# Altium schematic sheet Control.SchDoc
size A4
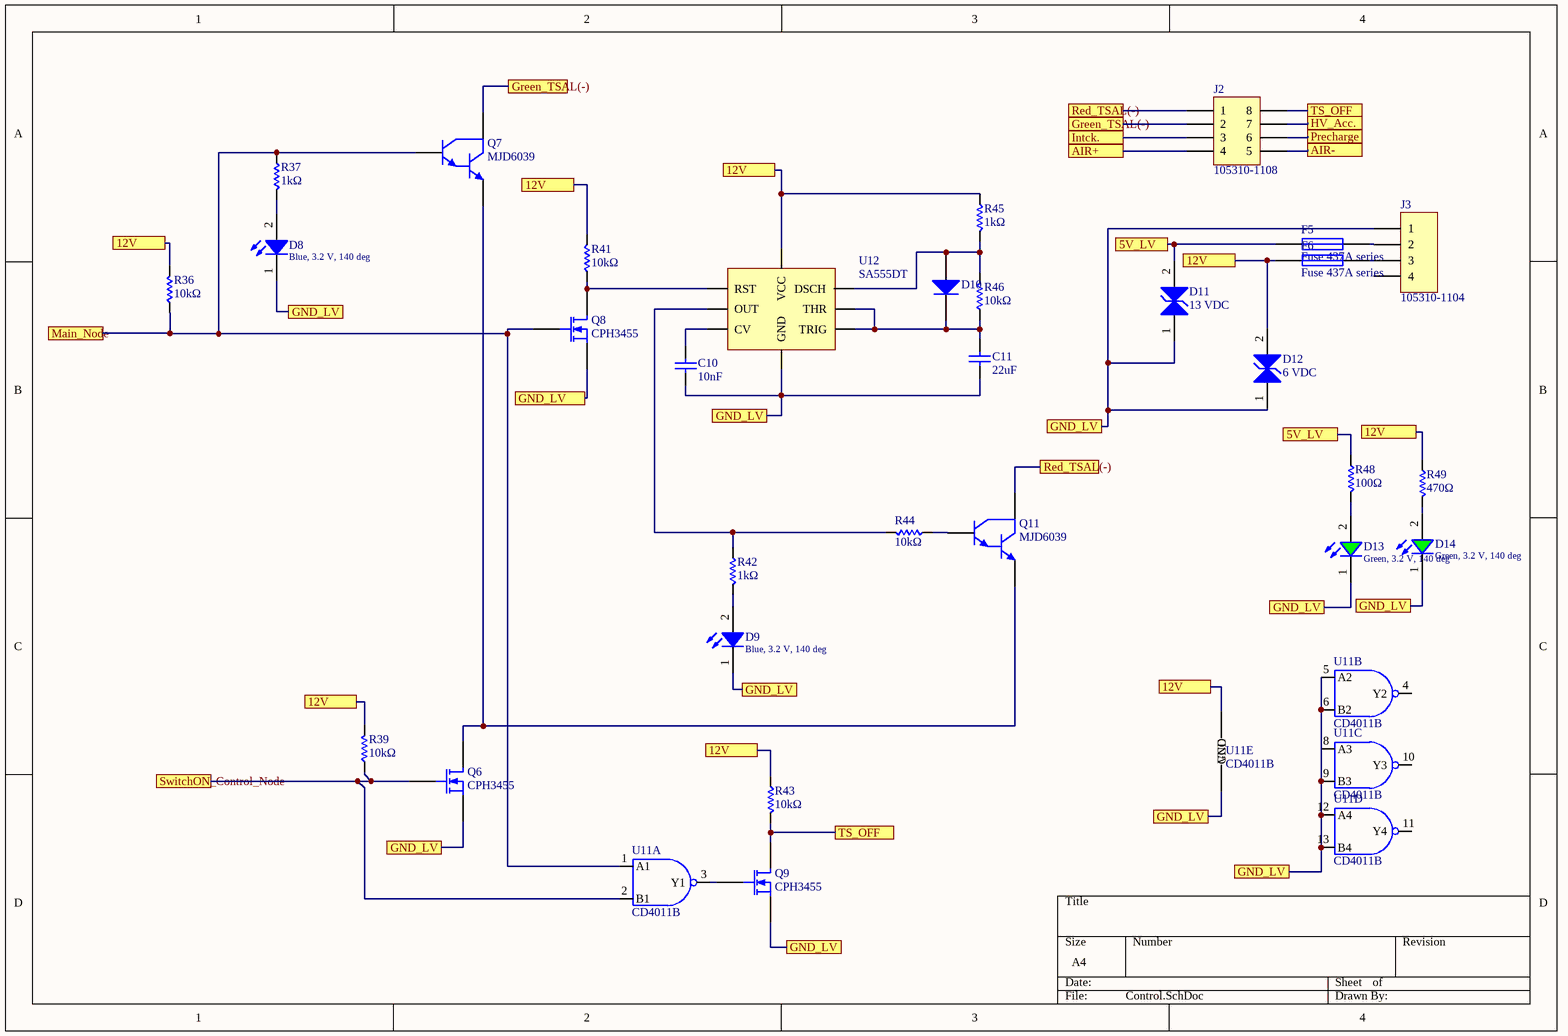
[diagram p0: Control.SchDoc]

## Parts
C10  10nF  [0805_2x1.25x0.8mm_Reflow Soldering]
C11  22uF  [0805_2x1.25x1.25mm_Reflow Soldering]
D8  Blue, 3.2 V, 140 deg  [WL-SMCW_0805]
D9  Blue, 3.2 V, 140 deg  [WL-SMCW_0805]
D10  (no value)  [MBR0540T1G]
D11  13 VDC  [WE-TVSP_DO-214AC_Bidirectional]
D12  6 VDC  [WE-TVSP_DO-214AC_Bidirectional]
D13  Green, 3.2 V, 140 deg  [WL-SMCW_0805]
D14  Green, 3.2 V, 140 deg  [WL-SMCW_0805]
F5  Fuse 437A series  [437A_Series]
F6  Fuse 437A series  [437A_Series]
J2  105310-1108  [105310-1108]
J3  105310-1104  [105310-1104]
Q6  CPH3455  [CPH3455]
Q7  MJD6039  [MJD6039]
Q8  CPH3455  [CPH3455]
Q9  CPH3455  [CPH3455]
Q11  MJD6039  [MJD6039]
R36  10kΩ  [CR0805]
R37  1kΩ  [CR0805]
R39  10kΩ  [CR0805]
R41  10kΩ  [CR0805]
R42  1kΩ  [CR0805]
R43  10kΩ  [CR0805]
R44  10kΩ  [CR0805]
R45  1kΩ  [CR0805]
R46  10kΩ  [CR0805]
R48  100Ω  [CR0805]
R49  470Ω  [CR0805]
U11  CD4011B  [CD4011BM]  (parts A,B,C,D,E of 5)
U12  SA555DT  [SA555DT]

## Ports
5V_LV, 12V, AIR+, AIR-, GND_LV, Green_TSAL(-), HV_Acc., Intck., Main_Node, Precharge, Red_TSAL(-), SwitchON_Control_Node, TS_OFF

## Nets
5V_LV: D11.2(C) F5.1 R48.2 ; port 5V_LV
12V: D12.2(C) F6.1 R36.1 R39.1 R41.1 R43.2 R45.2 R49.2 U11.14(VCC) U12.8(VCC) ; port 12V
AIR+: J2.4 ; port AIR+
AIR-: J2.5 ; port AIR-
GND_LV: C10.1 C11.1 D8.1(K) D9.1(K) D11.1(C) D12.1(C) D13.1(K) D14.1(K) J3.1 Q6.3(S) Q8.3(S) Q9.3(S) U11.5(A2) U11.6(B2) U11.7(GND) U11.8(A3) U11.9(B3) U11.12(A4) U11.13(B4) U12.1(GND) ; port GND_LV
Green_TSAL(-): J2.2 Q7.2(C) ; port Green_TSAL(-)
HV_Acc.: J2.7 ; port HV_Acc.
Intck.: J2.3 ; port Intck.
Main_Node: Q7.1(B) Q8.1(G) R36.2 R37.2 U11.1(A1) ; port Main_Node
Precharge: J2.6 ; port Precharge
Red_TSAL(-): J2.1 Q11.2(C) ; port Red_TSAL(-)
SwitchON_Control_Node: Q6.1(G) R39.2 U11.2(B1) ; port SwitchON_Control_Node
TS_OFF: J2.8 Q9.2(D) R43.1 ; port TS_OFF
NetC10_2: C10.2 U12.5(CV)
NetC11_2: C11.2 D10.1(K) R46.2 U12.2(TRIG) U12.6(THR)
NetD8_2: D8.2(A) R37.1
NetD9_2: D9.2(A) R42.1
NetD10_2: D10.2(A) R45.1 R46.1 U12.7(DSCH)
NetD13_2: D13.2(A) R48.1
NetD14_2: D14.2(A) R49.1
NetF5_2: F5.2 J3.2
NetF6_2: F6.2 J3.3
NetQ6_2: Q6.2(D) Q7.3(E) Q11.3(E)
NetQ8_2: Q8.2(D) R41.2 U12.4(RST)
NetQ9_1: Q9.1(G) U11.3(Y1)
NetQ11_1: Q11.1(B) R44.2
NetR42_2: R42.2 R44.1 U12.3(OUT)

Not connected (* = marked no-connect by the designer): J3 4; U11 4(Y2) 10(Y3) 11(Y4)

## Library data of the parts
C10 = 885012207092: WCAP-CSGP Ceramic Capacitors, 0805, X7R, 50V, 10nF; Rated Voltage: 50V DC; ComponentLink1Description: Manufacturer; ComponentLink1URL: http://www.we-online.de; ComponentLink2Description: Datasheet; ComponentLink2URL: http://katalog.we-online.de/pbs/datasheet/885012207092.pdf; Part Number: 885012207092; Published Date: Oct. 2017; Publisher: Wurth Elektronik; Size: 0805; Operating Temperature: -55 °C to +125 °C; Value: 10nF; Ceramic Type: X7R
C11 = 885012107011: WCAP-CSGP Ceramic Capacitors, 0805, X5R, 10V, 22uF; Rated Voltage: 10V DC; ComponentLink1Description: Manufacturer; ComponentLink1URL: http://www.we-online.de; ComponentLink2Description: Datasheet; ComponentLink2URL: http://katalog.we-online.de/pbs/datasheet/885012107011.pdf; Part Number: 885012107011; Published Date: Oct. 2017; Publisher: Wurth Elektronik; Size: 0805; Operating Temperature: -55 °C to +125 °C; Value: 22uF; Ceramic Type: X5R
D8 D9 = 150080BS75000: SMT Mono-color Chip LED Waterclear WL-SMCW, size 0805, Blue, 3.2 V, 140 deg, 145 mcd; Forward Voltage: 3.2 V; Viewing Angle: 140 deg; Peak Wavelength: 465 nm; Dominant Wavelength: 470 nm; Luminous Intensity: 145 mcd; Chip Technology: InGaN; ComponentLink1Description: Manufacturer; ComponentLink1URL: http://www.we-online.de; ComponentLink2Description: Datasheet; ComponentLink2URL: https://katalog.we-online.de/led/datasheet/150080BS75000.pdf; Part Number: 150080BS75000; Published Date: November 2018; Publisher: Wurth Elektronik; Size: 0805; Operating Temperature: -40 to 85 degC; Emitting Color: Blue; Mounting Technology: SMT; Packaging: Tape and Reel
D10 = MBR0540T1G: Surface Mount / Schottky Power Rectifier; Manufacturer: ON Semiconductor; ComponentLink1Description: Datasheet; ComponentLink1URL: https://www.onsemi.com/pub/Collateral/MBR0540T1-D.PDF
D11 = 824501131: WE-TVSP Power TVS Diode, size DO-214AC, Bidirectional, 400 W, 13 VDC; Peak Pulse Current: 18.6 A; Power Dissipation: 400 W; Reverse Breakdown Voltage: 15.15 V; Reverse Stand-Off Voltage: 13 V; Surge Clamping Voltage: 21.5 V; ComponentLink1Description: Manufacturer; ComponentLink1URL: http://www.we-online.de; ComponentLink2Description: Datasheet; ComponentLink2URL: https://katalog.we-online.de/pbs/datasheet/824501131.pdf; Part Number: 824501131; Published Date: September 2018; Publisher: Wurth Elektronik; Size: DO-214AC; Operating Temperature: -65 to 150 degC; Mounting Technology: SMT; Packaging: Tape and Reel; Polarity: Bidirectional
D12 = 824501600: WE-TVSP Power TVS Diode, size DO-214AC, Bidirectional, 400 W, 6 VDC; Peak Pulse Current: 38.8 A; Power Dissipation: 400 W; Reverse Breakdown Voltage: 7.02 V; Reverse Stand-Off Voltage: 6 V; Surge Clamping Voltage: 10.3 V; ComponentLink1Description: Manufacturer; ComponentLink1URL: http://www.we-online.de; ComponentLink2Description: Datasheet; ComponentLink2URL: https://katalog.we-online.de/pbs/datasheet/824501600.pdf; Part Number: 824501600; Published Date: September 2018; Publisher: Wurth Elektronik; Size: DO-214AC; Operating Temperature: -65 to 150 degC; Mounting Technology: SMT; Packaging: Tape and Reel; Polarity: Bidirectional
D13 D14 = 150080GS75000: SMT Mono-color Chip LED Waterclear WL-SMCW, size 0805, Green, 3.2 V, 140 deg, 450 mcd; Forward Voltage: 3.2 V; Viewing Angle: 140 deg; Peak Wavelength: 515 nm; Dominant Wavelength: 525 nm; Luminous Intensity: 450 mcd; Chip Technology: InGaN; ComponentLink1Description: Manufacturer; ComponentLink1URL: http://www.we-online.de; ComponentLink2Description: Datasheet; ComponentLink2URL: https://katalog.we-online.de/led/datasheet/150080GS75000.pdf; Part Number: 150080GS75000; Published Date: November 2018; Publisher: Wurth Elektronik; Size: 0805; Operating Temperature: -40 to 85 degC; Emitting Color: Green; Mounting Technology: SMT; Packaging: Tape and Reel
F5 F6 = Fuse 437A series: Fuse; Manufacturer: Littelfuse; ComponentLink1Description: Datasheet; ComponentLink1URL: https://www.littelfuse.com/~/media/electronics/datasheets/fuses/littelfuse_fuse_437a_datasheet.pdf.pdf
J2 = 105310-1108: Nano-Fit Vertical Header, Through Hole, 2.50mm Pitch, Dual Row, 8 Circuits; Manufacturer: Molex; ComponentLink1Description: Manufacturer; ComponentLink1URL: https://www.molex.com/molex/home; ComponentLink2Description: Datasheet; ComponentLink2URL: https://www.molex.com/pdm_docs/sd/1053101108_sd.pdf
J3 = 105310-1104: Nano-Fit Vertical Header, Through Hole, 2.50mm Pitch, Dual Row, 4 Circuits; Manufacturer: Molex; Rated Voltage: 250V DC; Rated Current: 6.5A; Operating Temperature: -40°C to +105°C; ComponentLink1Description: Manufacturer; ComponentLink1URL: https://www.molex.com/molex/home; ComponentLink2Description: Datasheet; ComponentLink2URL: https://www.molex.com/pdm_docs/sd/1053101104_sd.pdf
Q6 Q8 Q9 = CPH3455: Power MOSFET, 35V, 104 mohm, 3A, Single N-Channel; Manufacturer: ON Semiconductor; ComponentLink1Description: Datasheet; ComponentLink1URL: https://www.onsemi.com/pub/Collateral/CPH3455-D.PDF
Q7 Q11 = MJD6039: Darlington Power / Transistors; Manufacturer: ON Semiconductor; VoltageRating_BE: *; TemperatureRange: *; ComponentLink1Description: Datasheet; ComponentLink1URL: https://www.onsemi.com/pub/Collateral/MJD6039-D.PDF
R36 R39 R41 R43 R44 R46 = CR0805-JW-103ELF: Chip Resistor 0805; Manufacturer: Bourns; ComponentLink1Description: Datasheet; ComponentLink1URL: https://www.bourns.com/docs/product-datasheets/chpreztr.pdf?sfvrsn=566c91f1_11
R37 R42 R45 = CR0805-JW-102ELF: Chip Resistor 0805; Manufacturer: Bourns; ComponentLink1Description: Datasheet; ComponentLink1URL: https://www.bourns.com/docs/product-datasheets/chpreztr.pdf?sfvrsn=566c91f1_11
R48 = CR0805-FX-1000ELF: Chip Resistor 0805; Manufacturer: Bourns; ComponentLink1Description: Datasheet; ComponentLink1URL: https://www.bourns.com/docs/product-datasheets/chpreztr.pdf?sfvrsn=566c91f1_11
R49 = CR0805-FX-4700GLF: Chip Resistor 0805; Manufacturer: Bourns; ComponentLink1Description: Datasheet; ComponentLink1URL: https://www.bourns.com/docs/product-datasheets/chpreztr.pdf?sfvrsn=566c91f1_11
U11 = CD4011B: QUAD CMOS NAND GATES; Manufacturer: Texas Instruments; ComponentLink1Description: Datasheet; ComponentLink1URL: http://www.ti.com/lit/gpn/cd4011b
U12 = SA555DT: General Purpose Single Bipolar Timer; Manufacturer: ST Mircoelectronics; ComponentLink1Description: Datasheet; ComponentLink1URL: https://www.st.com/resource/en/datasheet/cd00000479.pdf